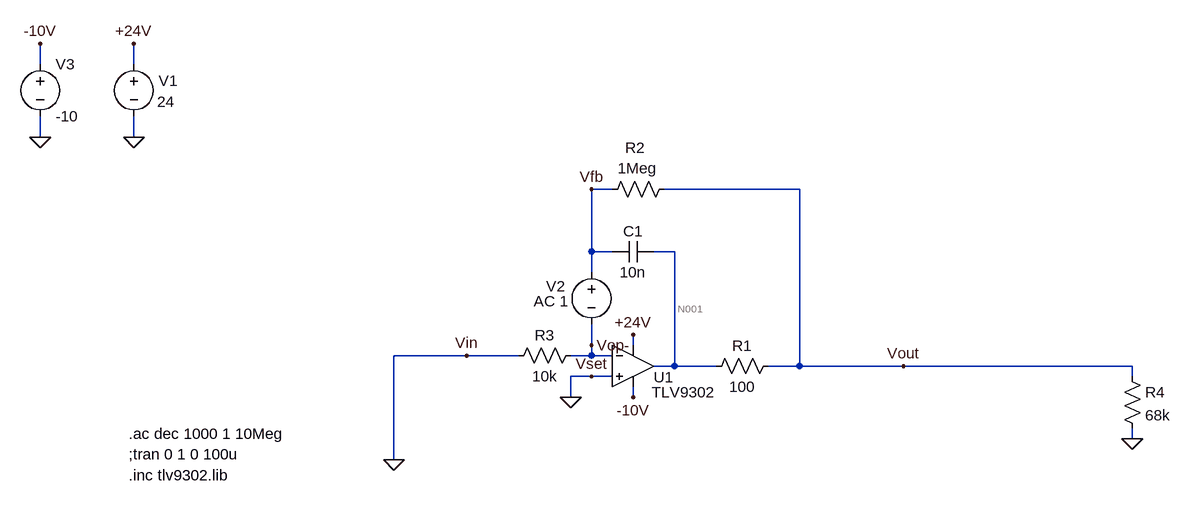
[diagram p0: schematic inverting_integrator_amp_phase_margin.asc]
inverting_integrator_amp_phase_margin.asc, the LTspice schematic file:
Version 4
SHEET 1 1044 680
WIRE -704 -304 -704 -336
WIRE -560 -304 -560 -336
WIRE -704 -192 -704 -224
WIRE -560 -192 -560 -224
WIRE 176 -112 144 -112
WIRE 464 -112 256 -112
WIRE 144 -16 144 -112
WIRE 176 -16 144 -16
WIRE 272 -16 240 -16
WIRE 144 16 144 -16
WIRE 144 128 144 96
WIRE 208 128 208 112
WIRE -48 144 -160 144
WIRE 32 144 -48 144
WIRE 144 144 144 128
WIRE 144 144 112 144
WIRE 176 144 144 144
WIRE 272 160 272 -16
WIRE 272 160 240 160
WIRE 336 160 272 160
WIRE 464 160 464 -112
WIRE 464 160 416 160
WIRE 624 160 464 160
WIRE 976 160 624 160
WIRE 144 176 112 176
WIRE 176 176 144 176
WIRE 976 176 976 160
WIRE 112 208 112 176
WIRE 208 208 208 192
WIRE 976 272 976 256
WIRE -160 304 -160 144
FLAG -560 -336 +24V
FLAG -560 -192 0
FLAG 208 112 +24V
FLAG -160 304 0
FLAG -704 -192 0
FLAG -704 -336 -10V
FLAG 208 208 -10V
FLAG 624 160 Vout
FLAG -48 144 Vin
FLAG 976 272 0
FLAG 144 176 Vset
FLAG 112 208 0
FLAG 144 -112 Vfb
FLAG 144 128 Vop-
SYMBOL OpAmps\\opamp2 208 96 R0
WINDOW 0 32 81 Left 2
WINDOW 3 29 104 Left 2
SYMATTR InstName U1
SYMATTR Value TLV9302
SYMBOL voltage -560 -320 R0
WINDOW 0 38 41 Left 2
WINDOW 3 36 73 Left 2
WINDOW 123 0 0 Left 0
WINDOW 39 0 0 Left 0
SYMATTR InstName V1
SYMATTR Value 24
SYMBOL cap 240 -32 R90
WINDOW 0 0 32 VBottom 2
WINDOW 3 32 32 VTop 2
SYMATTR InstName C1
SYMATTR Value 10n
SYMBOL res 432 144 R90
WINDOW 0 0 56 VBottom 2
WINDOW 3 32 56 VTop 2
SYMATTR InstName R1
SYMATTR Value 100
SYMBOL res 272 -128 R90
WINDOW 0 -32 61 VBottom 2
WINDOW 3 -32 57 VTop 2
SYMATTR InstName R2
SYMATTR Value 1Meg
SYMBOL voltage -704 -320 R0
WINDOW 123 0 0 Left 0
WINDOW 39 0 0 Left 0
SYMATTR InstName V3
SYMATTR Value -10
SYMBOL res 128 128 R90
WINDOW 0 0 56 VBottom 2
WINDOW 3 32 56 VTop 2
SYMATTR InstName R3
SYMATTR Value 10k
SYMBOL res 960 160 R0
SYMATTR InstName R4
SYMATTR Value 68k
SYMBOL voltage 144 0 R0
WINDOW 0 -70 37 Left 2
WINDOW 3 -89 60 Left 2
SYMATTR InstName V2
SYMATTR Value AC 1
TEXT -568 328 Left 2 !.inc tlv9302.lib
TEXT -568 296 Left 2 !;tran 0 1 0 100u
TEXT -568 264 Left 2 !.ac dec 1000 1 10Meg

The netlist it stands for:
* inverting_integrator_amp_phase_margin.asc
XU1 0 Vop- +24V -10V N001 TLV9302  ; pins In+ In- V+ V- OUT
V1 +24V 0 24
C1 N001 Vfb 10n
R1 Vout N001 100
R2 Vout Vfb 1Meg
V3 -10V 0 -10
R3 Vop- 0 10k
R4 Vout 0 68k
V2 Vfb Vop- AC 1
.inc tlv9302.lib
;tran 0 1 0 100u
.ac dec 1000 1 10Meg
.backanno
.end

* Results of the author's LTspice run, read from the files saved beside the schematic
* Operating Point, zero values left out:
*   V(n001) = -25.48 mV
*   V(+24v) = 24 V
*   V(-10v) = -10 V
*   V(vop-) = -251.6 µV
*   V(vfb) = -251.6 µV
*   V(vout) = -25.44 mV
*   I(R1) = 399.4 nA
*   I(R2) = -25.19 nA
*   I(R3) = -25.16 nA
*   I(R4) = -374.2 nA
*   I(V1) = -120 µA
*   I(V3) = 120.4 µA
*   I(V2) = -25.19 nA
*   Ix(u1:IN+) = -25 pA
*   Ix(u1:IN-) = -30 pA
*   Ix(u1:VCC) = 120 µA
*   Ix(u1:VEE) = -120.4 µA
*   Ix(u1:OUT) = 399.4 nA
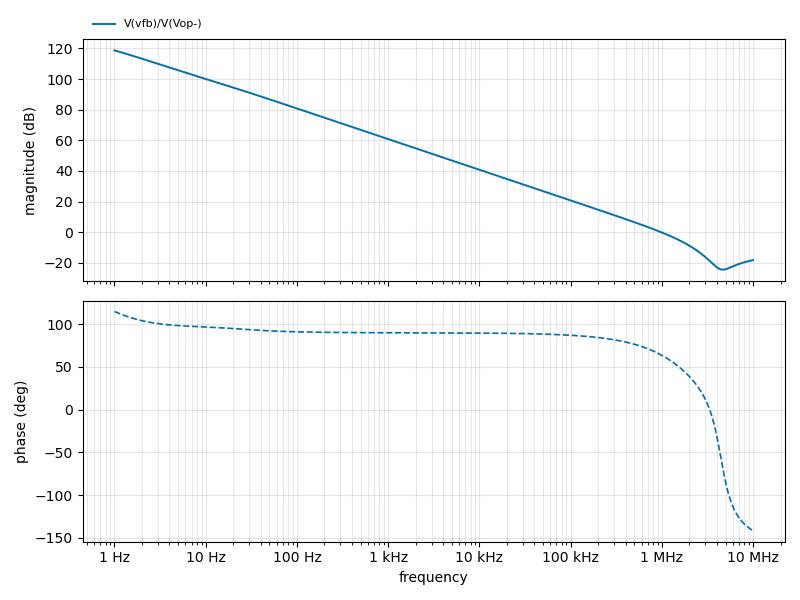
[diagram p1: AC Analysis of inverting_integrator_amp_phase_margin.asc, plotted from the saved traces]
* AC Analysis, 1 run:
*   V(vfb)/V(Vop-): 118.69 dB at 1 Hz, -18.21 dB at 10 MHz, peak 118.69 dB at 1 Hz, 3 dB below the peak at 1.486 Hz